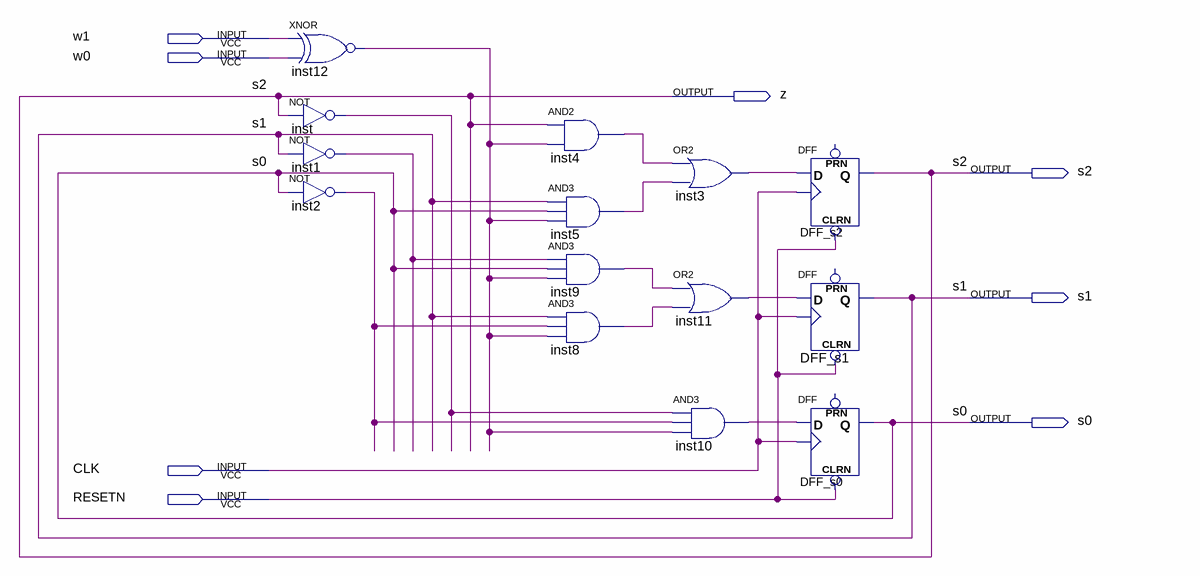
[diagram p0: schematic sheet]
// Quartus schematic Q3PaDesign.bdf as structural Verilog: 14 symbols, 8 pins
module Q3PaDesign (
  input  w1,
  input  w0,
  input  CLK,
  input  RESETN,
  output z,
  output s2,
  output s1,
  output s0
);

  wire inst1_out, inst2_out, inst3_out, inst4_out, inst5_out, inst8_out, inst9_out, inst10_out, inst11_out,
       inst12_out, inst_out;

  xnor inst12 (inst12_out, w1, w0);
  not inst (inst_out, s2);
  not inst1 (inst1_out, s1);
  not inst2 (inst2_out, s0);
  and inst4 (inst4_out, s2, inst12_out);
  and inst5 (inst5_out, s1, s0, inst12_out);
  and inst9 (inst9_out, inst1_out, s0, inst12_out);
  and inst8 (inst8_out, s1, inst2_out, inst12_out);
  or inst3 (inst3_out, inst4_out, inst5_out);
  or inst11 (inst11_out, inst9_out, inst8_out);
  and inst10 (inst10_out, inst_out, inst2_out, inst12_out);
  DFF DFF_s2 (.CLRN(RESETN), .CLK(CLK), .D(inst3_out), .Q(s2));  // open: PRN
  DFF DFF_s1 (.CLRN(RESETN), .CLK(CLK), .D(inst11_out), .Q(s1));  // open: PRN
  DFF DFF_s0 (.CLRN(RESETN), .CLK(CLK), .D(inst10_out), .Q(s0));  // open: PRN

  assign z = s2;
endmodule
